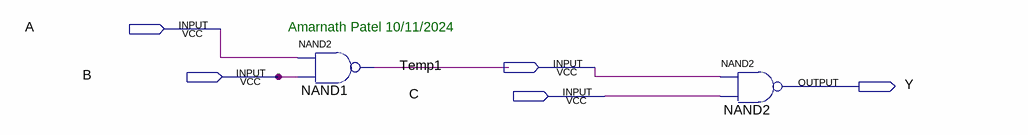
[diagram p0: schematic sheet]
// Quartus schematic NAND3_AmarnathPatel.bdf as structural Verilog: 2 symbols, 5 pins
module NAND3_AmarnathPatel (
  input  A,
  input  Temp1,
  input  B,
  input  C,
  output Y
);

  wire NAND1_out;

  nand NAND1 (NAND1_out, A, B);
  nand NAND2 (Y, Temp1, C);

  // Notes on the sheet:
  //   Amarnath Patel 10/11/2024
endmodule
